# EAGLE design 452_speaker (EAGLE 9.6.2)
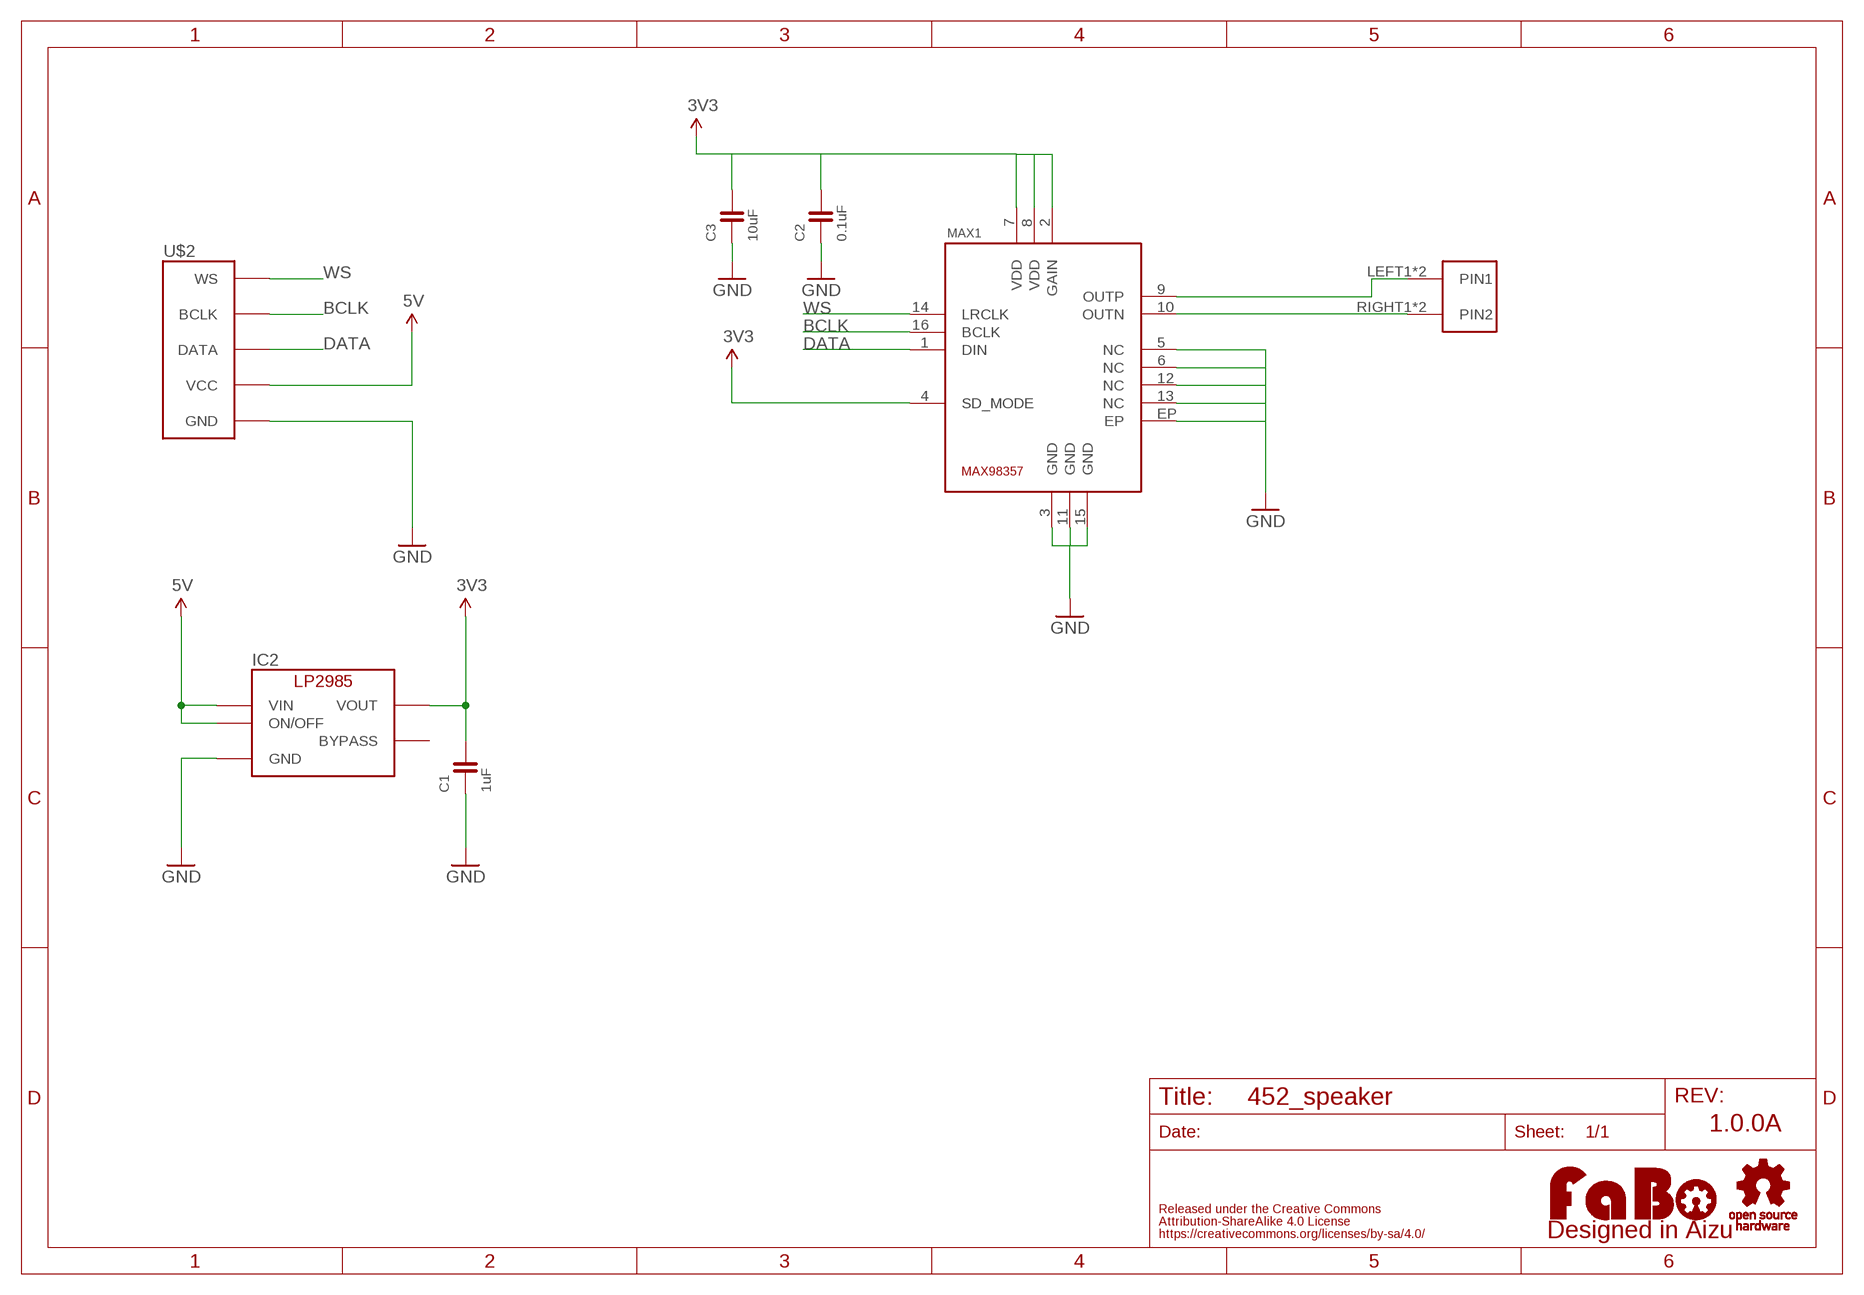
[diagram p0: schematic, sheet 1]

## Parts
C1  1uF  CAPACITOR-0603  [0603]
C2  0.1uF  CAPACITOR-0603  [0603]
C3  10uF  CAPACITOR-0603  [0603]
IC2  LP2985-33DBV  [SOT-23-5]
LOGO1  LOGO_FABO-M  [LOGO_FABO_M]
MAX1  MA-MAX98357  [MAXIM-MAX98357]
U$2  FABO_BRICK_I2S  [FABO_BRICK_I2S]
U$3  LOGO_OSHW-M_BOTTOM  [LOGO_OSHW_M_BOTTOM]
U$4  ML-1400-S1  [ML-1400-S1]

## Nets
3V3: C1.2 C2.2 C3.2 IC2.5(VOUT) MAX1.2(GAIN) MAX1.4(SD_MODE) MAX1.7(VDD) MAX1.8(VDD)
5V: IC2.1(VIN) IC2.3(ON/OFF) U$2.VCC
BCLK: MAX1.16(BCLK) U$2.BCLK
DATA: MAX1.1(DIN) U$2.DATA
GND: C1.1 C2.1 C3.1 IC2.2(GND) MAX1.3(GND) MAX1.5(NC) MAX1.6(NC) MAX1.11(GND) MAX1.12(NC) MAX1.13(NC) MAX1.15(GND) MAX1.EP U$2.GND
N$1: MAX1.10(OUTN) U$4.RIGHT1(PIN2) U$4.RIGHT2(PIN2)
N$2: MAX1.9(OUTP) U$4.LEFT1(PIN1) U$4.LEFT2(PIN1)
WS: MAX1.14(LRCLK) U$2.WS
Unconnected: IC2.4(BYPASS)

## Notes on the sheet
- 1.0.0A

## Library data of the parts
C1-C3 = FaBo-Capacitor:CAPACITOR: CAPACITOR
IC2 = FaBo-Supply:LP2985: LP2985
LOGO1 = component:LOGO_FABO
MAX1 = FaBo-Mems:MA-MAX98357
U$2 = FaBo-Template:FABO_BRICK_I2S
U$3 = component:LOGO_OSHW
U$4 = FaBo-Terminal:ML-1400-S1

## Board
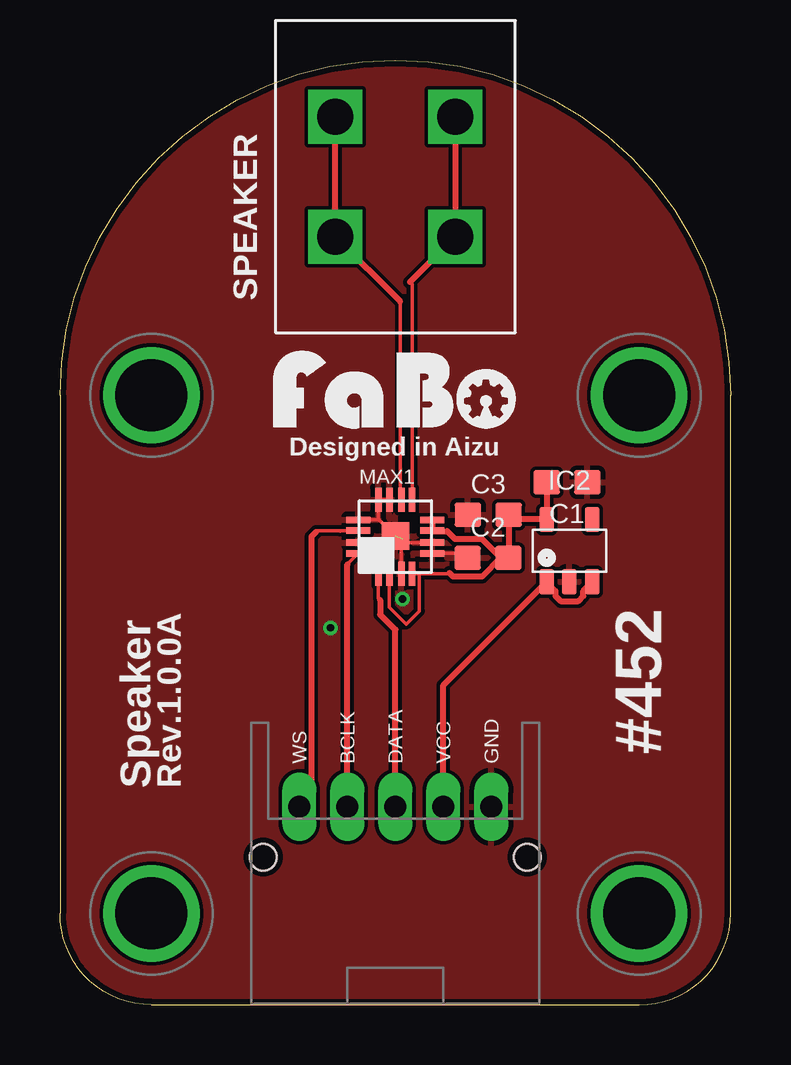
[diagram p1: board, top side]
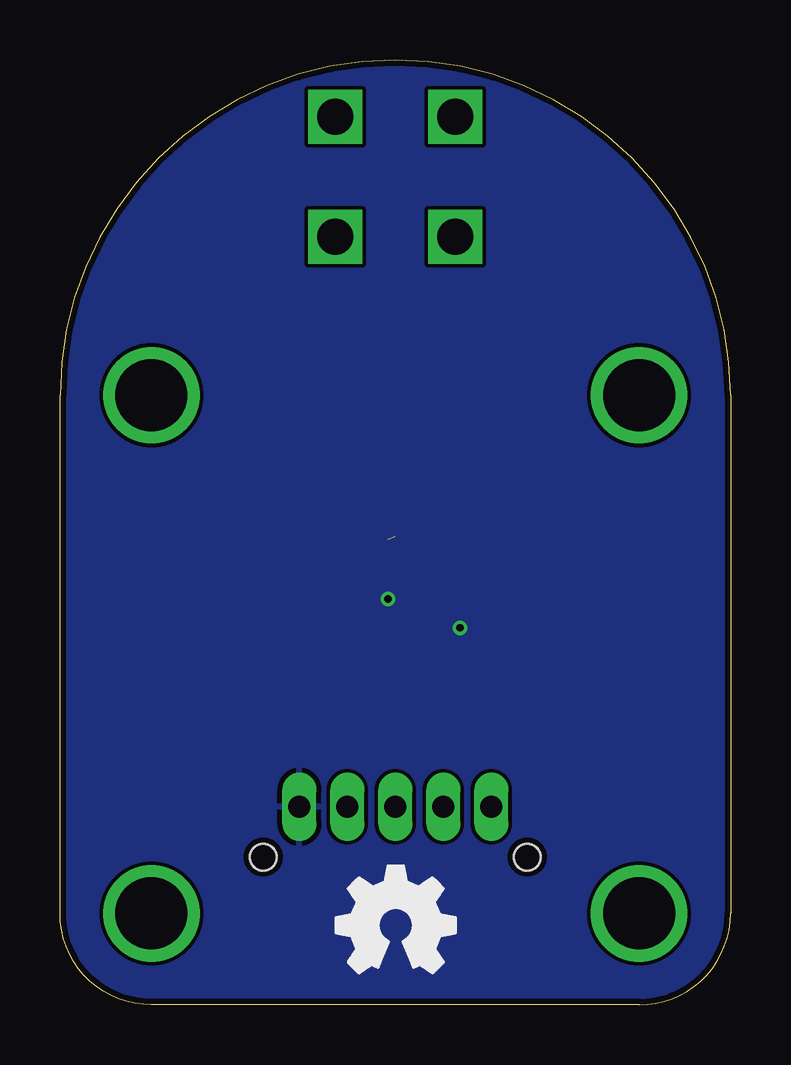
[diagram p2: board, bottom side, seen from below]

Size 27.94 x 39.37 mm. Coordinates in mm from the lower left corner, seen from the top.
Copper layers (1*16): Top 0.035mm / dielectric 1.6mm / Bottom 0.035mm
Design rules "PCBway": minimum track width 6mil, minimum drill 12mil, track to track 6mil, track to pad 6mil, pad to pad 6mil, via to via 6mil, smd to smd 6mil, copper to edge 10mil, drill to drill 10mil, minimum pad ring 10mil, minimum via ring 6mil, stop-mask expansion 2mil, vias tented up to drill 100mil, thermal gap 8mil

### Footprints (pad centres in the part's own frame; a part is rotated, then mirrored left to right if it is on the bottom)
0603 = smd 1.1 x 1: 1 -0.85,0; 2 0.85,0
SOT-23-5 = smd 0.6 x 1.05: 1 -0.95,-1.3; 2 0,-1.3; 3 0.95,-1.3; 4 0.95,1.3; 5 -0.95,1.3
MAXIM-MAX98357 = smd 0.27 x 1: 1 -0.7,-1.54; 2 -0.25,-1.54; 3 0.25,-1.54; 4 0.7,-1.54; 9 0.7,1.54; 10 0.25,1.54; 11 -0.25,1.54; 12 -0.7,1.54 | smd 1 x 0.27: 5 1.54,-0.7; 6 1.54,-0.25; 7 1.54,0.25; 8 1.54,0.7; 13 -1.54,0.7; 14 -1.54,0.25; 15 -1.54,-0.25; 16 -1.54,-0.7 | smd 1.143 x 1.143: EP 0.005,0.02
FABO_BRICK_I2S = drill 0.9 pad 1.422 long: BCLK -2,-8.255; DATA 0,-8.255; GND 4,-8.255; VCC 2,-8.255; WS -4,-8.255 | drill 3 pad 3.81: P$1 -10.16,8.89; P$2 10.16,8.89; P$3 -10.16,-12.7; P$4 10.16,-12.7 | hole 1.1: -5.5,-10.355; 5.5,-10.355
ML-1400-S1 = drill 1.5 square: LEFT1 -2.5,2.5; LEFT2 -2.5,-2.5; RIGHT1 2.5,2.5; RIGHT2 2.5,-2.5

### Placement (x,y rotation side)
C1  21.12,21.78 180 top
C2  17.84,18.62 0 top
C3  17.84,20.43 0 top
IC2  21.23,18.93 0 top
LOGO1  13.94,23.64 0 top
MAX1  13.97,19.51 0 top
U$2  13.97,16.51 0 top
U$3  13.94,3.32 0 top
U$4  13.97,34.51 180 top

### Tracks (layer width: path | path; a pad name or v marks a point on that pad's centre or on a via)
3V3
  Top 0.152: MAX1.2 13.72,16.56 14.42,15.86 14.97,16.41 14.97,17.97 | 14.97,17.97 16.2,17.97 16.22,18 | 14.97,17.97 MAX1.4 | MAX1.7 MAX1.8
  Top 0.254: C1.2 IC2.5 18.9,20.23 C3.2 18.7,18.64 C2.2 18.37,18.62 | 18.37,18.62 17.59,19.4 16.46,19.4 16.13,19.74 15.51,19.74 MAX1.8 | 18.37,18.62 17.59,17.85 16.38,17.85 16.22,18
5V
  Top 0.254: U$2.VCC 15.97,13.32 IC2.1 20.65,17.25 20.65,17.04 20.86,16.82 21.59,16.82 21.8,17.04 21.8,17.25 IC2.3
BCLK
  Top 0.152: 11.97,18.35 MAX1.16
  Top 0.254: U$2.BCLK 11.97,18.35
DATA
  Top 0.152: MAX1.1 13.27,16.94 13.34,16.87
  Top 0.254: U$2.DATA 13.97,15.64 13.34,16.27 13.34,16.87
GND  (via drill 0.3)  (1 unrouted)
  Top 0.152: MAX1.6 14.42,19.26 14.37,19.31 | 14.37,19.31 14.27,19.31 | 14.28,19.4 14.37,19.31 | C2.1 16.8,18.81 MAX1.5 | MAX1.13 13.29,20.21 MAX1.EP | MAX1.EP 13.27,20.24 MAX1.12 MAX1.11 | MAX1.EP 14.22,19.29 MAX1.3
  Top 0.254: 16.7,18.91 C2.1
  other vias: 11.27,15.71 11.27,15.71 14.27,16.91
  pour Bottom: -0.03,-0.49 28.34,-0.49 28.34,39.51 -0.03,39.51
  pour Top: -0.03,-0.49 28.34,-0.49 28.34,39.51 -0.03,39.51
N$1
  Top 0.152: 14.17,29.31 14.17,21.1 MAX1.10
  Top 0.254: 14.17,29.31 U$4.RIGHT1 U$4.RIGHT2
N$2
  Top 0.152: MAX1.9 14.67,30.02 14.57,30.11
  Top 0.254: 14.57,30.11 U$4.LEFT1 U$4.LEFT2
WS
  Top 0.152: 11.67,19.74 11.69,19.76 MAX1.14 10.72,19.76 10.67,19.71
  Top 0.254: 10.67,19.71 10.47,19.51 10.47,8.76 U$2.WS

### Text on the board
tPlace: SPEAKER | Designed in Aizu | #452 | Speaker | Rev.1.0.0A